# Altium schematic sheet BMS_Link_Rev0.SchDoc
size A4; SheetNumber: 1; SheetTotal: 3
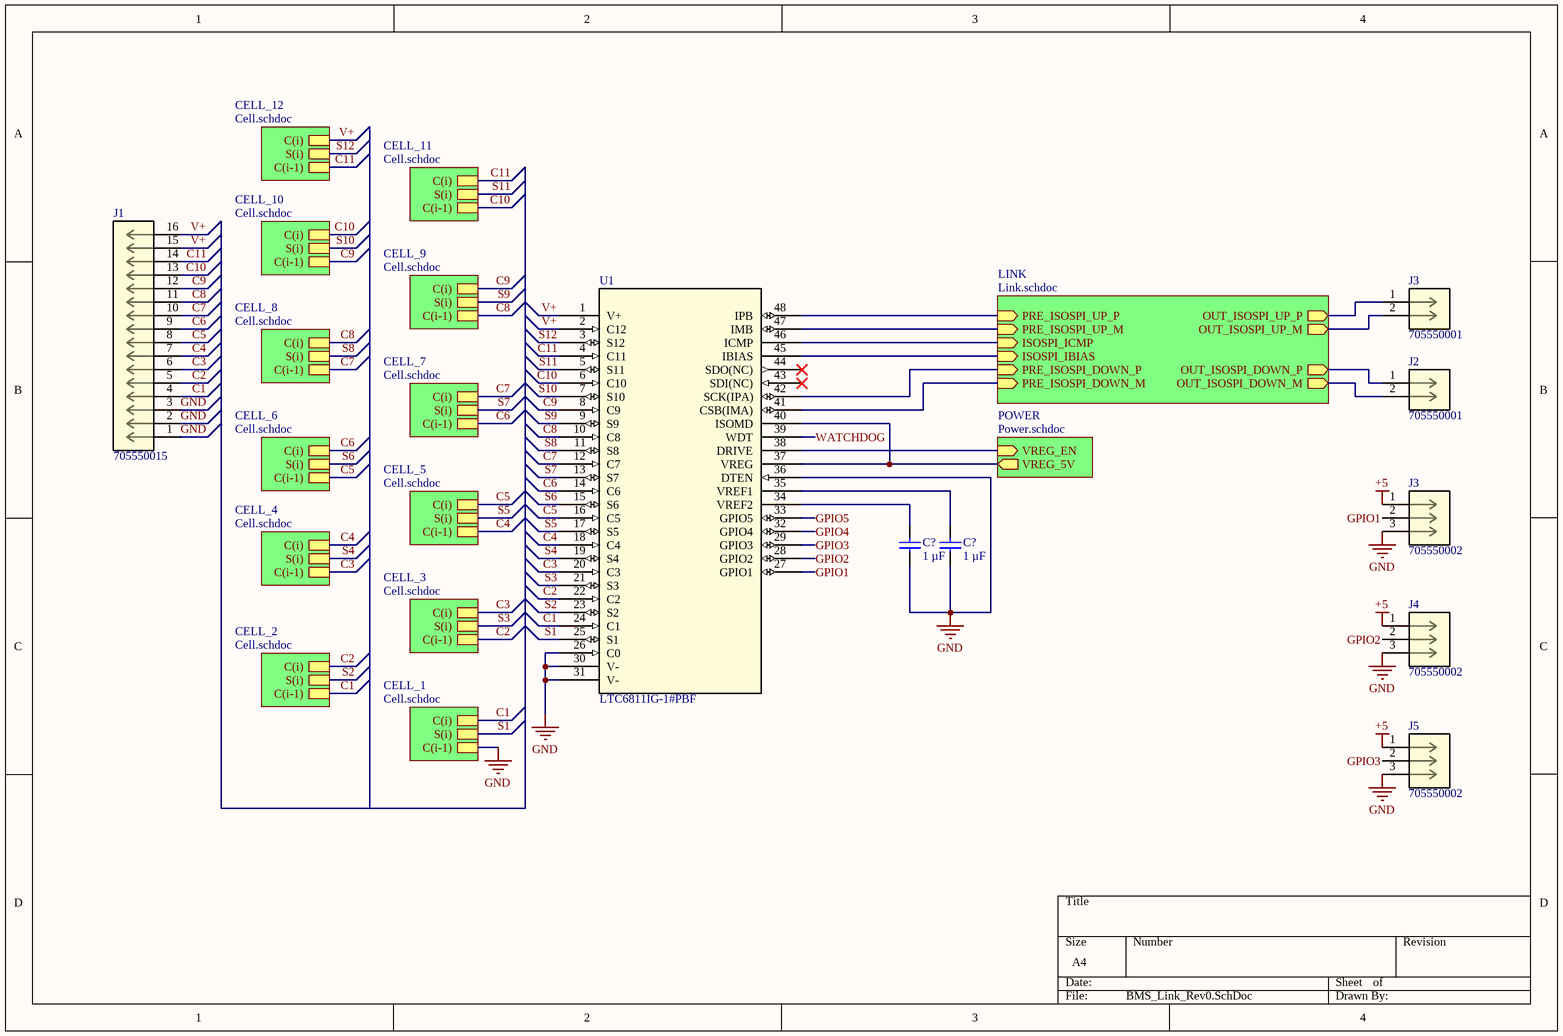
[diagram p0: BMS_Link_Rev0.SchDoc]

## Parts
(Parts that share a designator on the sheet are numbered #1, #2 ... from top to bottom, then left to right.)
C?#1  value 1 µF  [0805_CAPACITOR]  (hidden comment: CL21B105KAFNNNE)
C?#2  value 1 µF  [0805_CAPACITOR]  (hidden comment: CL21B105KAFNNNE)
J1  705550015  [MOLEX-CON-16P-705550000]
J2  705550001  [CONN_705550000-SD_02_MOL]
J3#1  705550001  [CONN_705550000-SD_02_MOL]
J3#2  705550002  [CONN_705550000-SD_03_MOL]
J4  705550002  [CONN_705550000-SD_03_MOL]
J5  705550002  [CONN_705550000-SD_03_MOL]
U1  LTC6811IG-1#PBF  [48-SSOP]

## Sub-sheets
CELL_1 = Cell.schdoc: C(i), C(i-1), S(i)
CELL_2 = Cell.schdoc: C(i), C(i-1), S(i)
CELL_3 = Cell.schdoc: C(i), C(i-1), S(i)
CELL_4 = Cell.schdoc: C(i), C(i-1), S(i)
CELL_5 = Cell.schdoc: C(i), C(i-1), S(i)
CELL_6 = Cell.schdoc: C(i), C(i-1), S(i)
CELL_7 = Cell.schdoc: C(i), C(i-1), S(i)
CELL_8 = Cell.schdoc: C(i), C(i-1), S(i)
CELL_9 = Cell.schdoc: C(i), C(i-1), S(i)
CELL_10 = Cell.schdoc: C(i), C(i-1), S(i)
CELL_11 = Cell.schdoc: C(i), C(i-1), S(i)
CELL_12 = Cell.schdoc: C(i), C(i-1), S(i)
LINK = Link.schdoc: PRE_ISOSPI_UP_P (in), PRE_ISOSPI_UP_M (in), ISOSPI_ICMP (in), ISOSPI_IBIAS (in), PRE_ISOSPI_DOWN_P (in), PRE_ISOSPI_DOWN_M (in), OUT_ISOSPI_UP_P (out), OUT_ISOSPI_UP_M (out), OUT_ISOSPI_DOWN_P (out), OUT_ISOSPI_DOWN_M (out)
POWER = Power.schdoc: VREG_EN (in), VREG_5V (out)

## Nets
+5: J3#2.1 J4.1 J5.1
GND: C?#1.2 C?#2.2 J1.1 J1.2 J1.3 J3#2.3 J4.3 J5.3 U1.26(C0) U1.30(V-) U1.31(V-) U1.36(DTEN) ; sheet CELL_1/C(i-1)
C1: J1.4 U1.24(C1) ; sheet CELL_1/C(i), sheet CELL_2/C(i-1)
C2: J1.5 U1.22(C2) ; sheet CELL_3/C(i-1), sheet CELL_2/C(i)
C3: J1.6 U1.20(C3) ; sheet CELL_3/C(i), sheet CELL_4/C(i-1)
C4: J1.7 U1.18(C4) ; sheet CELL_5/C(i-1), sheet CELL_4/C(i)
C5: J1.8 U1.16(C5) ; sheet CELL_5/C(i), sheet CELL_6/C(i-1)
C6: J1.9 U1.14(C6) ; sheet CELL_7/C(i-1), sheet CELL_6/C(i)
C7: J1.10 U1.12(C7) ; sheet CELL_7/C(i), sheet CELL_8/C(i-1)
C8: J1.11 U1.10(C8) ; sheet CELL_9/C(i-1), sheet CELL_8/C(i)
C9: J1.12 U1.8(C9) ; sheet CELL_9/C(i), sheet CELL_10/C(i-1)
C10: J1.13 U1.6(C10) ; sheet CELL_11/C(i-1), sheet CELL_10/C(i)
C11: J1.14 U1.4(C11) ; sheet CELL_11/C(i), sheet CELL_12/C(i-1)
GPIO1: J3#2.2 U1.27(GPIO1)
GPIO2: J4.2 U1.28(GPIO2)
GPIO3: J5.2 U1.29(GPIO3)
GPIO4: U1.32(GPIO4)
GPIO5: U1.33(GPIO5)
S1: U1.25(S1) ; sheet CELL_1/S(i)
S2: U1.23(S2) ; sheet CELL_2/S(i)
S3: U1.21(S3) ; sheet CELL_3/S(i)
S4: U1.19(S4) ; sheet CELL_4/S(i)
S5: U1.17(S5) ; sheet CELL_5/S(i)
S6: U1.15(S6) ; sheet CELL_6/S(i)
S7: U1.13(S7) ; sheet CELL_7/S(i)
S8: U1.11(S8) ; sheet CELL_8/S(i)
S9: U1.9(S9) ; sheet CELL_9/S(i)
S10: U1.7(S10) ; sheet CELL_10/S(i)
S11: U1.5(S11) ; sheet CELL_11/S(i)
S12: U1.3(S12) ; sheet CELL_12/S(i)
V+: J1.15 J1.16 U1.1(V+) U1.2(C12) ; sheet CELL_12/C(i)
WATCHDOG: U1.39(WDT)
NetC?#1_1: C?#1.1 U1.34(VREF2)
NetC?#2_1: C?#2.1 U1.35(VREF1)
NetJ2_1: J2.1 ; sheet LINK/OUT_ISOSPI_DOWN_P
NetJ2_2: J2.2 ; sheet LINK/OUT_ISOSPI_DOWN_M
NetJ3#1_1: J3#1.1 ; sheet LINK/OUT_ISOSPI_UP_P
NetJ3#1_2: J3#1.2 ; sheet LINK/OUT_ISOSPI_UP_M
NetU1_37: U1.37(VREG) U1.40(ISOMD) ; sheet POWER/VREG_5V
NetU1_38: U1.38(DRIVE) ; sheet POWER/VREG_EN
NetU1_41: U1.41(CSB(IMA)) ; sheet LINK/PRE_ISOSPI_DOWN_M
NetU1_42: U1.42(SCK(IPA)) ; sheet LINK/PRE_ISOSPI_DOWN_P
NetU1_45: U1.45(IBIAS) ; sheet LINK/ISOSPI_IBIAS
NetU1_46: U1.46(ICMP) ; sheet LINK/ISOSPI_ICMP
NetU1_47: U1.47(IMB) ; sheet LINK/PRE_ISOSPI_UP_M
NetU1_48: U1.48(IPB) ; sheet LINK/PRE_ISOSPI_UP_P

Not connected (* = marked no-connect by the designer): U1 43(SDI(NC))* 44(SDO(NC))*

## Library data of the parts
C?#1 C?#2 = CL21B105KAFNNNE: 1 µF ±10% 25V Ceramic Capacitor X7R 0805 (2012 Metric)
J1 = 705550015: 2.54mm Pitch SL Header, Single Row, Right Angle, 3.05mm Pocket, Shrouded, with Press-fit Plastic Peg, 16 Circuits, Tin (Sn) Plating; Manufacturer_Name: Molex Connector Corporation; Copyright: Copyright (C) 2025 Ultra Librarian. All rights reserved.; Manufacturer_Part_Number: 705550015; Datasheet: https://www.molex.com/en-us/products/part-detail-pdf/705550015?display=pdf; RefDes: RefDes; Type: Type
J2 J3#1 = 705550001: 2.54mm Pitch SL Header, Single Row, Right Angle, 3.05mm Pocket, Shrouded, with Press-fit Plastic Peg, 2 Circuits, Tin (Sn) Plating; Manufacturer_Name: Molex Connector Corporation; Copyright: Copyright (C) 2025 Ultra Librarian. All rights reserved.; Manufacturer_Part_Number: 705550001; Datasheet: https://www.molex.com/en-us/products/part-detail-pdf/705550001?display=pdf; RefDes: RefDes; Type: Type
J3#2 J4 J5 = 705550002: 2.54mm Pitch SL Header, Single Row, Right Angle, 3.05mm Pocket, Shrouded, with Press-fit Plastic Peg, 3 Circuits, Tin (Sn) Plating; Manufacturer_Name: Molex Connector Corporation; Copyright: Copyright (C) 2025 Ultra Librarian. All rights reserved.; Manufacturer_Part_Number: 705550002; Datasheet: https://www.molex.com/en-us/products/part-detail-pdf/705550002?display=pdf; RefDes: RefDes; Type: Type
U1 = LTC6811IG-1PBF: 12 Channel Multicell Battery Monitor with Daisy Chain Interface, Generation 4; Manufacturer_Name: Analog Devices Inc; Type: Power Management; Copyright: Copyright (C) 2025 Ultra Librarian. All rights reserved.; Manufacturer_Part_Number: LTC6811IG-1#PBF; Datasheet: https://www.analog.com/media/en/technical-documentation/data-sheets/LTC6811-1-6811-2.pdf; RefDes: RefDes